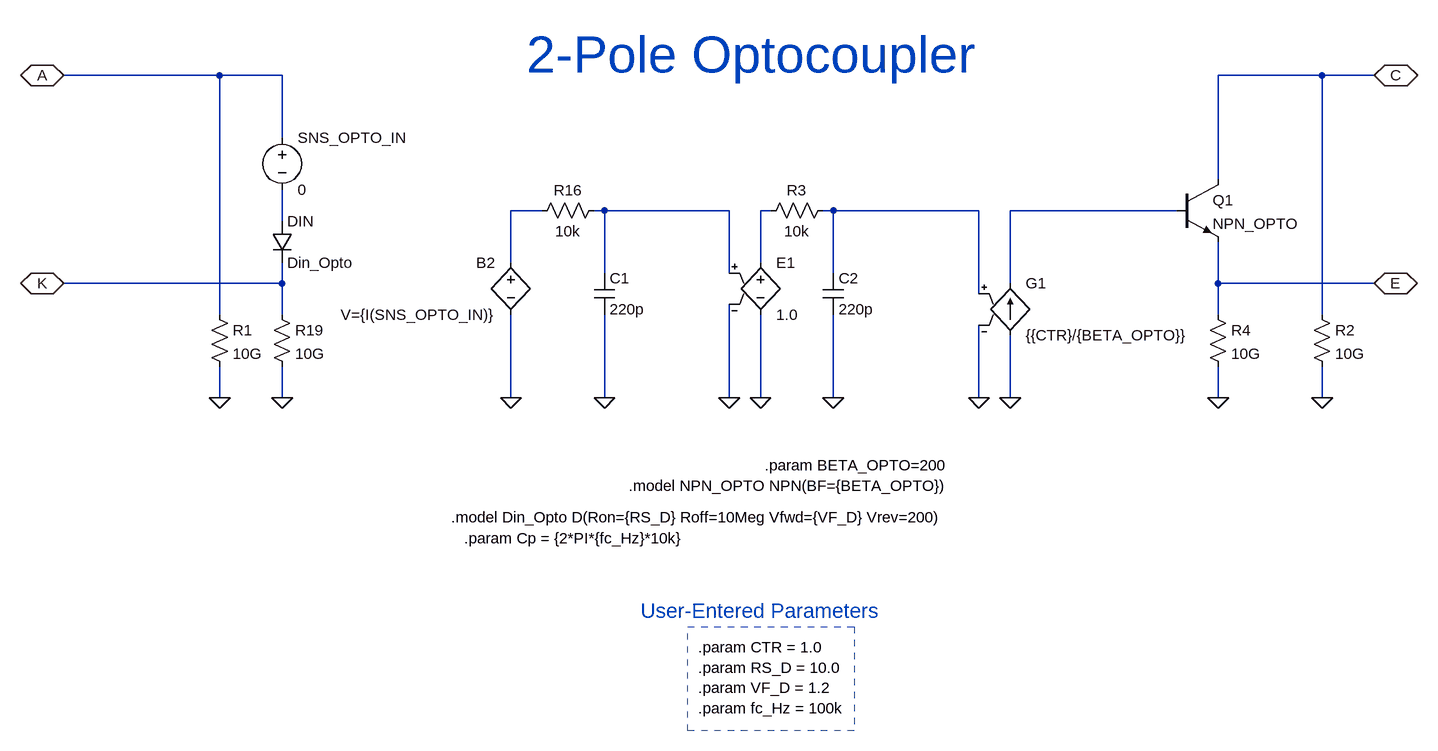
[diagram p0: schematic Opto_Two_Pole.asc]
Opto_Two_Pole.asc, the LTspice schematic file:
Version 4.1
SHEET 1 8304 5380
WIRE 2688 3808 2448 3808
WIRE 2784 3808 2688 3808
WIRE 4384 3808 4224 3808
WIRE 4464 3808 4384 3808
WIRE 2784 3904 2784 3808
WIRE 4224 3968 4224 3808
WIRE 3184 4016 3136 4016
WIRE 3280 4016 3264 4016
WIRE 3472 4016 3280 4016
WIRE 3536 4016 3520 4016
WIRE 3632 4016 3616 4016
WIRE 3856 4016 3632 4016
WIRE 4160 4016 3904 4016
WIRE 2784 4032 2784 3984
WIRE 3136 4096 3136 4016
WIRE 3520 4096 3520 4016
WIRE 3280 4112 3280 4016
WIRE 3472 4112 3472 4016
WIRE 3632 4112 3632 4016
WIRE 2784 4128 2784 4096
WIRE 2784 4128 2448 4128
WIRE 3904 4128 3904 4016
WIRE 4224 4128 4224 4064
WIRE 4464 4128 4224 4128
WIRE 3856 4144 3856 4016
WIRE 2688 4176 2688 3808
WIRE 2784 4176 2784 4128
WIRE 4224 4176 4224 4128
WIRE 4384 4176 4384 3808
WIRE 2688 4304 2688 4256
WIRE 2784 4304 2784 4256
WIRE 3136 4304 3136 4176
WIRE 3280 4304 3280 4176
WIRE 3472 4304 3472 4160
WIRE 3520 4304 3520 4176
WIRE 3632 4304 3632 4176
WIRE 3856 4304 3856 4192
WIRE 3904 4304 3904 4208
WIRE 4224 4304 4224 4256
WIRE 4384 4304 4384 4256
FLAG 4224 4304 0
FLAG 3280 4304 0
FLAG 3136 4304 0
FLAG 2784 4304 0
FLAG 2688 4304 0
FLAG 4384 4304 0
FLAG 3472 4304 0
FLAG 3520 4304 0
FLAG 3856 4304 0
FLAG 3632 4304 0
FLAG 3904 4304 0
FLAG 2448 3808 A
IOPIN 2448 3808 BiDir
FLAG 2448 4128 K
IOPIN 2448 4128 BiDir
FLAG 4464 3808 C
IOPIN 4464 3808 BiDir
FLAG 4464 4128 E
IOPIN 4464 4128 BiDir
SYMBOL diode 2768 4032 R0
SYMATTR InstName DIN
SYMATTR Value Din_Opto
SYMBOL res 4208 4160 R0
SYMATTR InstName R4
SYMATTR Value 10G
SYMBOL cap 3264 4112 R0
SYMATTR InstName C1
SYMATTR Value 220p
SYMBOL res 3280 4000 R90
WINDOW 0 0 56 VBottom 2
WINDOW 3 32 56 VTop 2
SYMATTR InstName R16
SYMATTR Value 10k
SYMBOL npn 4160 3968 R0
SYMATTR InstName Q1
SYMATTR Value NPN_OPTO
SYMBOL bv 3136 4080 M0
SYMATTR InstName B2
SYMATTR Value V={I(SNS_OPTO_IN)}
SYMBOL voltage 2784 3888 R0
WINDOW 123 0 0 Left 0
WINDOW 39 0 0 Left 0
SYMATTR InstName SNS_OPTO_IN
SYMATTR Value 0
SYMBOL res 2768 4160 R0
SYMATTR InstName R19
SYMATTR Value 10G
SYMBOL res 2672 4160 R0
SYMATTR InstName R1
SYMATTR Value 10G
SYMBOL res 4368 4160 R0
SYMATTR InstName R2
SYMATTR Value 10G
SYMBOL g 3904 4112 R0
SYMATTR InstName G1
SYMATTR Value {{CTR}/{BETA_OPTO}}
SYMBOL e 3520 4080 R0
SYMATTR InstName E1
SYMATTR Value 1.0
SYMBOL cap 3616 4112 R0
SYMATTR InstName C2
SYMATTR Value 220p
SYMBOL res 3632 4000 R90
WINDOW 0 0 56 VBottom 2
WINDOW 3 32 56 VTop 2
SYMATTR InstName R3
SYMATTR Value 10k
TEXT 3424 4688 Left 2 !.param CTR = 1.0\n.param RS_D = 10.0\n.param VF_D = 1.2\n.param fc_Hz = 100k
TEXT 3808 4488 Right 2 !.model Din_Opto D(Ron={RS_D} Roff=10Meg Vfwd={VF_D} Vrev=200)
TEXT 3808 4408 Right 2 !.param BETA_OPTO=200\n.model NPN_OPTO NPN(BF={BETA_OPTO})
TEXT 3160 3776 Left 6 ;2-Pole Optocoupler
TEXT 3064 4520 Left 2 !.param Cp = {2*PI*{fc_Hz}*10k}
TEXT 3336 4632 Left 3 ;User-Entered Parameters
RECTANGLE Normal 3664 4816 3408 4656 1

The netlist it stands for:
* Opto_Two_Pole.asc
DIN N006 K Din_Opto
R4 E 0 10G
C1 N002 0 220p
R16 N002 N001 10k
Q1 C N005 E 0 NPN_OPTO
B2 N001 0 V={I(SNS_OPTO_IN)}
V§SNS_OPTO_IN A N006 0
R19 K 0 10G
R1 A 0 10G
R2 C 0 10G
G1 0 N005 N004 0 {{CTR}/{BETA_OPTO}}
E1 N003 0 N002 0 1.0
C2 N004 0 220p
R3 N004 N003 10k
.model D D
.lib standard.dio
.model NPN NPN
.model PNP PNP
.lib standard.bjt
.param CTR = 1.0
.param RS_D = 10.0
.param VF_D = 1.2
.param fc_Hz = 100k
.model Din_Opto D(Ron={RS_D} Roff=10Meg Vfwd={VF_D} Vrev=200)
.param BETA_OPTO=200
.model NPN_OPTO NPN(BF={BETA_OPTO})
* 2-Pole Optocoupler
.param Cp = {2*PI*{fc_Hz}*10k}
* User-Entered Parameters
.backanno
.end